# Altium schematic sheet sensors.SchDoc: Sensors
size A4; Author: Csorvasi Gabor; CompanyName: BME-AUT; Organization: BME AUT; Address1: Magyar tudósok krt. 2.; Address2: Q épület; Address3: Budapest; Address4: H-1117; DocumentNumber: 1; Revision: v1.0; SheetNumber: 1; SheetTotal: 2
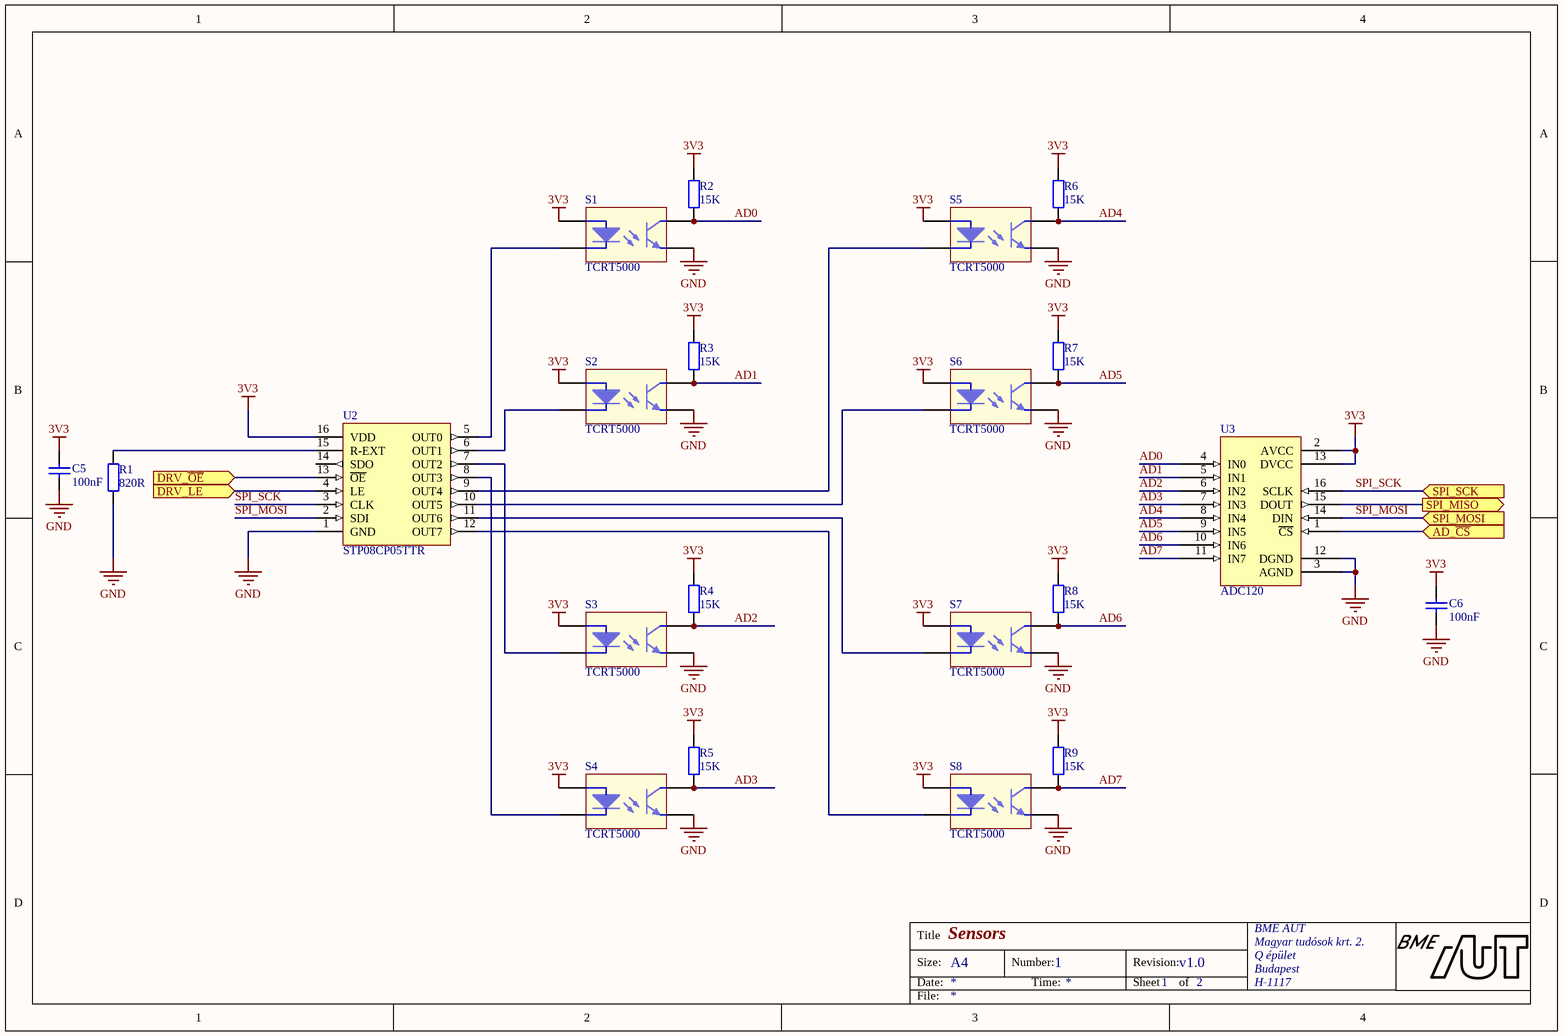
[diagram p0: sensors.SchDoc]

## Parts
C5  100nF  [FP_0805_CAP_085]
C6  100nF  [FP_0805_CAP_085]
R1  820R  [FP_0805_RES]
R2  15K  [FP_0805_RES]
R3  15K  [FP_0805_RES]
R4  15K  [FP_0805_RES]
R5  15K  [FP_0805_RES]
R6  15K  [FP_0805_RES]
R7  15K  [FP_0805_RES]
R8  15K  [FP_0805_RES]
R9  15K  [FP_0805_RES]
S1  TCRT5000  [TCRT5000]
S2  TCRT5000  [TCRT5000]
S3  TCRT5000  [TCRT5000]
S4  TCRT5000  [TCRT5000]
S5  TCRT5000  [TCRT5000]
S6  TCRT5000  [TCRT5000]
S7  TCRT5000  [TCRT5000]
S8  TCRT5000  [TCRT5000]
U2  STP08CP05TTR  [TSOP65P640X120-16M]
U3  ADC120  [TSOP65P640X120-16N]

## Ports
AD_~{CS} (in), DRV_LE (in), DRV_~{OE} (in), SPI_MISO (out), SPI_MOSI (in), SPI_SCK (in)

## Nets
3V3: C5.2 C6.2 R2.2 R3.2 R4.2 R5.2 R6.2 R7.2 R8.2 R9.2 S1.1(A) S2.1(A) S3.1(A) S4.1(A) S5.1(A) S6.1(A) S7.1(A) S8.1(A) U2.16(VDD) U3.2(AVCC) U3.13(DVCC)
GND: C5.1 C6.1 R1.1 S1.4(E) S2.4(E) S3.4(E) S4.4(E) S5.4(E) S6.4(E) S7.4(E) S8.4(E) U2.1(GND) U3.3(AGND) U3.12(DGND)
AD0: R2.1 S1.3(C) U3.4(IN0)
AD1: R3.1 S2.3(C) U3.5(IN1)
AD2: R4.1 S3.3(C) U3.6(IN2)
AD3: R5.1 S4.3(C) U3.7(IN3)
AD4: R6.1 S5.3(C) U3.8(IN4)
AD5: R7.1 S6.3(C) U3.9(IN5)
AD6: R8.1 S7.3(C) U3.10(IN6)
AD7: R9.1 S8.3(C) U3.11(IN7)
AD_~{CS}: U3.1(~{CS}) ; port AD_~{CS}
DRV_LE: U2.4(LE) ; port DRV_LE
DRV_~{OE}: U2.13(~{OE}) ; port DRV_~{OE}
SPI_MISO: U3.15(DOUT) ; port SPI_MISO
SPI_MOSI: U2.2(SDI) U3.14(DIN) ; port SPI_MOSI
SPI_SCK: U2.3(CLK) U3.16(SCLK) ; port SPI_SCK
NetR1_2: R1.2 U2.15(R-EXT)
NetS1_2: S1.2(K) U2.5(OUT0)
NetS2_2: S2.2(K) U2.6(OUT1)
NetS3_2: S3.2(K) U2.7(OUT2)
NetS4_2: S4.2(K) U2.8(OUT3)
NetS5_2: S5.2(K) U2.9(OUT4)
NetS6_2: S6.2(K) U2.10(OUT5)
NetS7_2: S7.2(K) U2.11(OUT6)
NetS8_2: S8.2(K) U2.12(OUT7)

Not connected (* = marked no-connect by the designer): U2 14(SDO)

## Notes on the sheet
- Title
- Size:
- Date:
- A4
- Number:
- Time:
- Revision:
- Sheet
- of
- File:

## Library data of the parts
C5 C6 = CAP: Capacitor; Name: 100nF 0805 10% 50V X7R 0805B104K500CT (WAL); Supplier: Lomex; Reference: 82-10-76; Value: 100nF
R1 = RES: Resistor; Name: 820R 0805 1% WR08X8200FTL 0.125W (WAL); Supplier: Lomex; Reference: 80-33-03; Value: 820R
R2-R9 = RES: Resistor; Name: 15K4 0805 1% CR-05FL7---15K4 0.125W (VIK); Supplier: Lomex; Reference: 80-52-63; Value: 15K
S1-S8 = TCRT5000: Reflective Optical Sensor; pin to pad: 1>A 2>Cath 3>Coll 4>E; Reference: SAMPLE; Supplier: Vishay; Name: TCRT5000
U2 = STP08CP05TTR: Low voltage, low current power 8-bit shift register; Reference: 2460707; Name: STP08DP05TTR -  Led Driver, 8 Outputs; Supplier: Farnell
U3 = ADC120: Reference: 511-ADC120IPT; Name: ADC120IPT; Supplier: Mouser